# Altium schematic sheet 3_Airframe-Memory_1.SchDoc
size A3; SheetNumber: 4; SheetTotal: 9
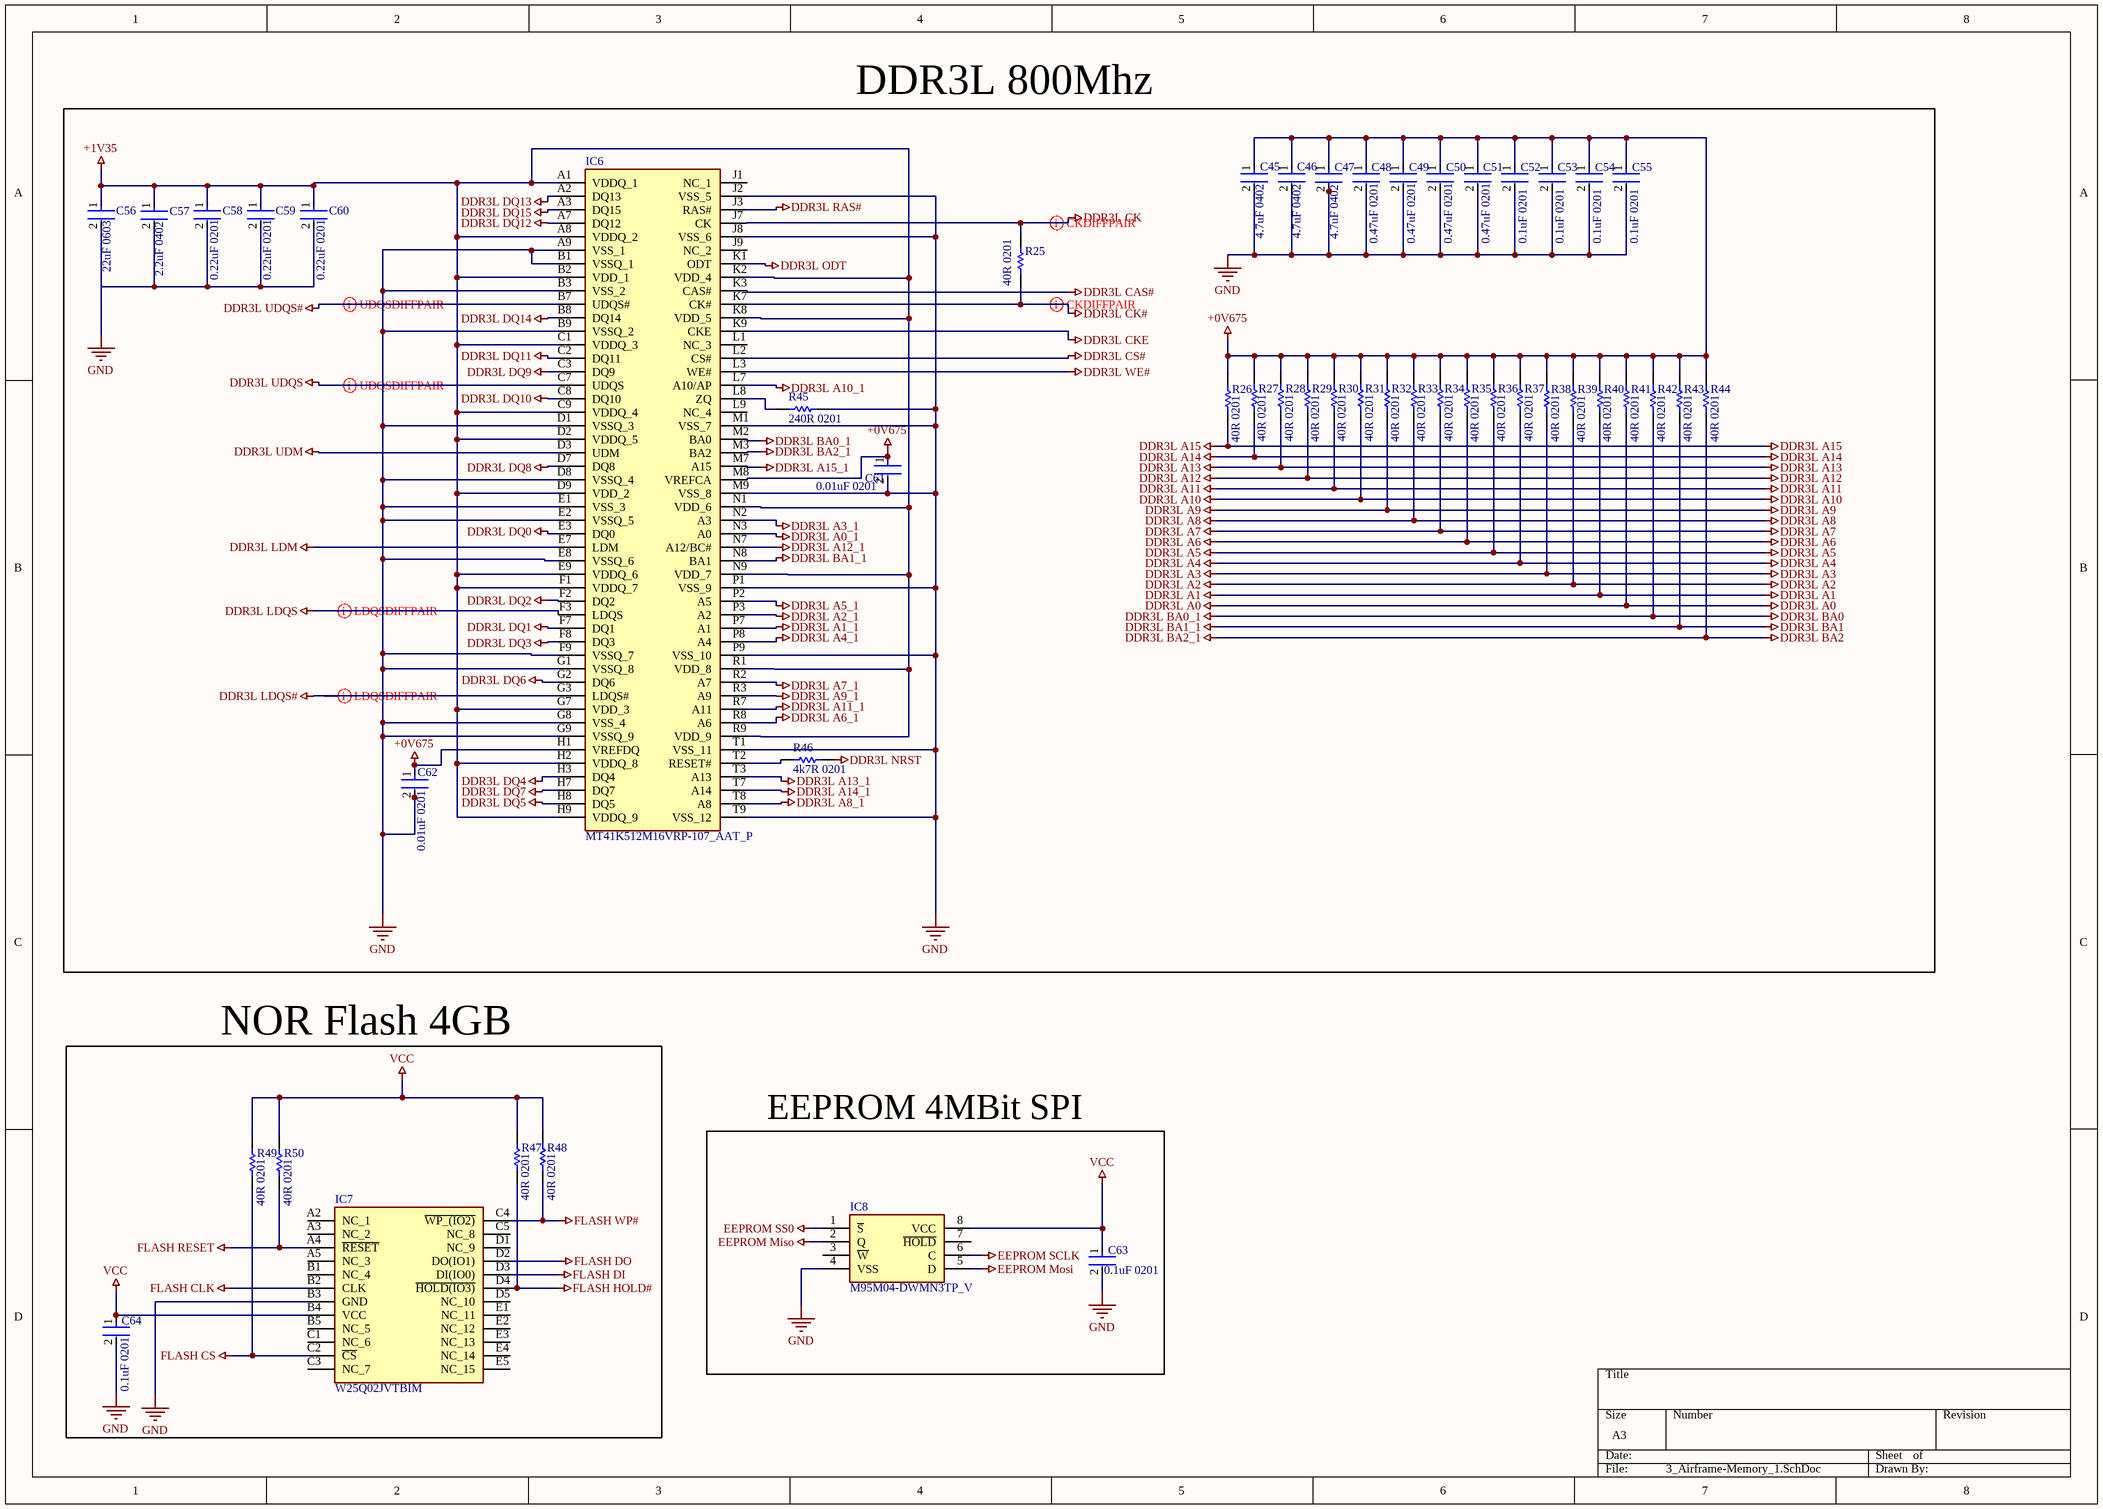
[diagram p0: 3_Airframe-Memory_1.SchDoc]

## Parts
C45  4.7uF 0402  [FP-C0402C225M9PACTU-MFG]
C46  4.7uF 0402  [FP-C0402C225M9PACTU-MFG]
C47  4.7uF 0402  [FP-C0402C225M9PACTU-MFG]
C48  0.47uF 0201  [FP-C0603-030-0_03-IPC_C]
C49  0.47uF 0201  [FP-C0603-030-0_03-IPC_C]
C50  0.47uF 0201  [FP-C0603-030-0_03-IPC_C]
C51  0.47uF 0201  [FP-C0603-030-0_03-IPC_C]
C52  0.1uF 0201  [FP-C0603-030-0_03-IPC_C]
C53  0.1uF 0201  [FP-C0603-030-0_03-IPC_C]
C54  0.1uF 0201  [FP-C0603-030-0_03-IPC_C]
C55  0.1uF 0201  [FP-C0603-030-0_03-IPC_C]
C56  22uF 0603  [FP-GRM188-0_2-IPC_C]
C57  2.2uF 0402  [FP-C0402C225M9PACTU-MFG]
C58  0.22uF 0201  [FP-C0603-030-0_03-IPC_C]
C59  0.22uF 0201  [FP-C0603-030-0_03-IPC_C]
C60  0.22uF 0201  [FP-C0603-030-0_03-IPC_C]
C61  0.01uF 0201  [FP-C0603-030-0_03-IPC_C]
C62  0.01uF 0201  [FP-C0603-030-0_03-IPC_C]
C63  0.1uF 0201  [FP-C0603-030-0_03-IPC_C]
C64  0.1uF 0201  [FP-C0603-030-0_03-IPC_C]
IC6  MT41K512M16VRP-107_AAT_P  [BGA96C80P9X16_800X1400X120]
IC7  W25Q02JVTBIM  [BGA24C100P5X5_600X800X120]
IC8  M95M04-DWMN3TP_V  [SOIC127P600X175-8N]
R25  40R 0201  [RESC0603X28X15NL05T05]
R26  40R 0201  [RESC0603X28X15NL05T05]
R27  40R 0201  [RESC0603X28X15NL05T05]
R28  40R 0201  [RESC0603X28X15NL05T05]
R29  40R 0201  [RESC0603X28X15NL05T05]
R30  40R 0201  [RESC0603X28X15NL05T05]
R31  40R 0201  [RESC0603X28X15NL05T05]
R32  40R 0201  [RESC0603X28X15NL05T05]
R33  40R 0201  [RESC0603X28X15NL05T05]
R34  40R 0201  [RESC0603X28X15NL05T05]
R35  40R 0201  [RESC0603X28X15NL05T05]
R36  40R 0201  [RESC0603X28X15NL05T05]
R37  40R 0201  [RESC0603X28X15NL05T05]
R38  40R 0201  [RESC0603X28X15NL05T05]
R39  40R 0201  [RESC0603X28X15NL05T05]
R40  40R 0201  [RESC0603X28X15NL05T05]
R41  40R 0201  [RESC0603X28X15NL05T05]
R42  40R 0201  [RESC0603X28X15NL05T05]
R43  40R 0201  [RESC0603X28X15NL05T05]
R44  40R 0201  [RESC0603X28X15NL05T05]
R45  240R 0201  [RESC0603X28X15NL05T05]
R46  4k7R 0201  [RESC0603X28X15NL05T05]
R47  40R 0201  [RESC0603X28X15NL05T05]
R48  40R 0201  [RESC0603X28X15NL05T05]
R49  40R 0201  [RESC0603X28X15NL05T05]
R50  40R 0201  [RESC0603X28X15NL05T05]

## Nets
+0V675: C45.1 C46.1 C47.1 C48.1 C49.1 C50.1 C51.1 C52.1 C53.1 C54.1 C55.1 C61.1 C62.1 IC6.H1(VREFDQ) IC6.M8(VREFCA) R26.2 R27.2 R28.2 R29.2 R30.2 R31.2 R32.2 R33.2 R34.2 R35.2 R36.2 R37.2 R38.2 R39.2 R40.2 R41.2 R42.2 R43.2 R44.2
+1V35: C56.1 C57.1 C58.1 C59.1 C60.1 IC6.A1(VDDQ_1) IC6.A8(VDDQ_2) IC6.B2(VDD_1) IC6.C1(VDDQ_3) IC6.C9(VDDQ_4) IC6.D2(VDDQ_5) IC6.D9(VDD_2) IC6.E9(VDDQ_6) IC6.F1(VDDQ_7) IC6.G7(VDD_3) IC6.H2(VDDQ_8) IC6.H9(VDDQ_9) IC6.K2(VDD_4) IC6.K8(VDD_5) IC6.N1(VDD_6) IC6.N9(VDD_7) IC6.R1(VDD_8) IC6.R9(VDD_9)
DDR3L A0: R41.1
DDR3L A0_1: IC6.N3(A0)
DDR3L A1: R40.1
DDR3L A1_1: IC6.P7(A1)
DDR3L A2: R39.1
DDR3L A2_1: IC6.P3(A2)
DDR3L A3: R38.1
DDR3L A3_1: IC6.N2(A3)
DDR3L A4: R37.1
DDR3L A4_1: IC6.P8(A4)
DDR3L A5: R36.1
DDR3L A5_1: IC6.P2(A5)
DDR3L A6: R35.1
DDR3L A6_1: IC6.R8(A6)
DDR3L A7: R34.1
DDR3L A7_1: IC6.R2(A7)
DDR3L A8: R33.1
DDR3L A8_1: IC6.T8(A8)
DDR3L A9: R32.1
DDR3L A9_1: IC6.R3(A9)
DDR3L A10: R31.1
DDR3L A10_1: IC6.L7(A10/AP)
DDR3L A11: R30.1
DDR3L A11_1: IC6.R7(A11)
DDR3L A12: R29.1
DDR3L A12_1: IC6.N7(A12/BC#)
DDR3L A13: R28.1
DDR3L A13_1: IC6.T3(A13)
DDR3L A14: R27.1
DDR3L A14_1: IC6.T7(A14)
DDR3L A15: R26.1
DDR3L A15_1: IC6.M7(A15)
DDR3L BA0: IC6.M2(BA0) R42.1  [also labelled DDR3L BA0_1]
DDR3L BA1: IC6.N8(BA1) R43.1  [also labelled DDR3L BA1_1]
DDR3L BA2: IC6.M3(BA2) R44.1  [also labelled DDR3L BA2_1]
DDR3L CAS#: IC6.K3(CAS#)
DDR3L CK: IC6.J7(CK) R25.2
DDR3L CK#: IC6.K7(CK#) R25.1
DDR3L CKE: IC6.K9(CKE)
DDR3L CS#: IC6.L2(CS#)
DDR3L DQ0: IC6.E3(DQ0)
DDR3L DQ1: IC6.F7(DQ1)
DDR3L DQ2: IC6.F2(DQ2)
DDR3L DQ3: IC6.F8(DQ3)
DDR3L DQ4: IC6.H3(DQ4)
DDR3L DQ5: IC6.H8(DQ5)
DDR3L DQ6: IC6.G2(DQ6)
DDR3L DQ7: IC6.H7(DQ7)
DDR3L DQ8: IC6.D7(DQ8)
DDR3L DQ9: IC6.C3(DQ9)
DDR3L DQ10: IC6.C8(DQ10)
DDR3L DQ11: IC6.C2(DQ11)
DDR3L DQ12: IC6.A7(DQ12)
DDR3L DQ13: IC6.A2(DQ13)
DDR3L DQ14: IC6.B8(DQ14)
DDR3L DQ15: IC6.A3(DQ15)
DDR3L LDM: IC6.E7(LDM)
DDR3L LDQS: IC6.F3(LDQS)
DDR3L LDQS#: IC6.G3(LDQS#)
DDR3L NRST: R46.2
DDR3L ODT: IC6.K1(ODT)
DDR3L RAS#: IC6.J3(RAS#)
DDR3L UDM: IC6.D3(UDM)
DDR3L UDQS: IC6.C7(UDQS)
DDR3L UDQS#: IC6.B7(UDQS#)
DDR3L WE#: IC6.L3(WE#)
EEPROM Miso: IC8.2(Q)
EEPROM Mosi: IC8.5(D)
EEPROM SCLK: IC8.6(C)
EEPROM SS0: IC8.1(~{S})
FLASH CLK: IC7.B2(CLK)
FLASH CS: IC7.C2(~{CS}) R49.1
FLASH DI: IC7.D3(DI(IO0))
FLASH DO: IC7.D2(DO(IO1))
FLASH HOLD#: IC7.D4(~{HOLD(IO3)}) R47.1
FLASH RESET: IC7.A4(~{RESET}) R50.1
FLASH WP#: IC7.C4(~{WP_(IO2)}) R48.1
GND: C45.2 C46.2 C47.2 C48.2 C49.2 C50.2 C51.2 C52.2 C53.2 C54.2 C55.2 C56.2 C57.2 C58.2 C59.2 C60.2 C61.2 C62.2 C63.2 C64.2 IC6.A9(VSS_1) IC6.B1(VSSQ_1) IC6.B3(VSS_2) IC6.B9(VSSQ_2) IC6.D1(VSSQ_3) IC6.D8(VSSQ_4) IC6.E1(VSS_3) IC6.E2(VSSQ_5) IC6.E8(VSSQ_6) IC6.F9(VSSQ_7) IC6.G1(VSSQ_8) IC6.G8(VSS_4) IC6.G9(VSSQ_9) IC6.J2(VSS_5) IC6.J8(VSS_6) IC6.M1(VSS_7) IC6.M9(VSS_8) IC6.P1(VSS_9) IC6.P9(VSS_10) IC6.T1(VSS_11) IC6.T9(VSS_12) IC7.B3(GND) IC8.4(VSS) R45.2
VCC: C63.1 C64.1 IC7.B4(VCC) IC8.8(VCC) R47.2 R48.2 R49.2 R50.2
NetIC6_L8: IC6.L8(ZQ) R45.1
NetIC6_T2: IC6.T2(RESET#) R46.1

Not connected (* = marked no-connect by the designer): IC6 J1(NC_1) J9(NC_2) L1(NC_3) L9(NC_4); IC7 A2(NC_1) A3(NC_2) A5(NC_3) B1(NC_4) B5(NC_5) C1(NC_6) C3(NC_7) C5(NC_8) D1(NC_9) D5(NC_10) E1(NC_11) E2(NC_12) E3(NC_13) E4(NC_14) E5(NC_15); IC8 3(~{W}) 7(~{HOLD})

## Layout directives
differential pair: DDR3L CK, DDR3L CK#, DDR3L LDQS, DDR3L LDQS#, DDR3L UDQS, DDR3L UDQS#

## Notes on the sheet
- DDR3L 800Mhz
- NOR Flash 4GB
- EEPROM 4MBit SPI

## Library data of the parts
C45-C47 C57 = CMP-2008-02064-3: CAP CER 2.2UF 6.3V X5R 0402; Tolerance: 20%; Dissipation Factor: 5%; Dielectric Material: Ceramic; Lead Free: Lead Free; Depth: 0.5mm; Series: C; Termination: SMD/SMT; Case Code (Metric): 1005; Case/Package: 0402; Dielectric: X5R; RoHS Compliant: Yes; Thickness: 0.022inch; Voltage Rating: 6.3V; Voltage: 6.3V; Height: 0.5mm; Mount: Surface Mount; Construction: Flat; Case Code (Imperial): 0402; Min Operating Temperature: -55°C; Contact Plating: Tin; Radiation Hardening: No; Number of Pins: 2; Voltage Rating (DC): 6.3V; Capacitance: 2.2uF; Width: 0.5mm; Package Quantity: 1; Packaging: Tape and Reel; Max Operating Temperature: 85°C; Length: 1mm; REACH SVHC: No SVHC
C48-C55 C58-C64 = CMP-08246-007095-1: Multilayer Ceramic Capacitors 220nF ±10% 6.3V X6S SMD 0201; Dielectric: X6S; Resistor Type: Ceramic; Length: 0.6mm; Capacitance: 220nF; Case Code (Metric): 0603; Series: C; Width: 0.012inch; Height: 0.3mm; Voltage Rating: 6.3V; Max Operating Temperature: 105°C; REACH SVHC: No SVHC; RoHS Compliant: Yes; Tolerance: 10%; Termination: SMD/SMT; Case/Package: 0201; Case Code (Imperial): 0201; Weight: 6E-06oz; Lead Free: Lead Free; Construction: Flat; Thickness: 300um; Mount: Surface Mount; Dielectric Material: Ceramic; Voltage Rating (DC): 6.3V; Packaging: Cut Tape; Package Quantity: 1; Min Operating Temperature: -55°C; Depth: 0.3mm
C56 = CMP-2000-06337-3: Chip Multilayer Ceramic Capacitors for General Purpose, 0603, 22uF, X5R, 15%, 20%, 10V; Tolerance: 20%; Weight: 0.000222oz; Material: Ceramic; Depth: 0.8mm; Length: 1.6mm; Termination: SMD/SMT; Capacitance: 22uF; Packaging: Tape and Reel; Width: 0.8mm; Voltage Rating: 10V; Case Code (Imperial): 0603; Mount: Surface Mount; Voltage Rating (DC): 10V; Case/Package: 0603; Thickness: 0.039inch; REACH SVHC: No SVHC; Dielectric: X5R; Height: 0.8mm; Package Quantity: 4000; Case Code (Metric): 1608; Min Operating Temperature: -55°C; Lead Free: Lead Free; Max Operating Temperature: 85°C
IC6 = MT41K512M16VRP-107_AAT_P: Integrated Circuit; Manufacturer_Name: Micron; Manufacturer_Part_Number: MT41K512M16VRP-107 AAT:P; Datasheet Link: https://media-www.micron.com/-/media/client/global/documents/products/data-sheet/dram/ddr3/ddr3l_8gb_x16_1cs_twindie_v00h.pdf?rev=22af12ce29de4defa41e06e9beebd61f; Height: 1.2mm; Mouser Part Number: 340-446578-TRAY; Mouser Price/Stock: https://www.mouser.co.uk/ProductDetail/Micron/MT41K512M16VRP-107-AATP?qs=vHuUswq2%252Bsx8WmnHcfGgyw%3D%3D; Arrow Part Number: MT41K512M16VRP-107 AAT:P; Arrow Price/Stock: https://www.arrow.com/en/products/mt41k512m16vrp-107-aatp/micron-technology?region=nac
IC7 = W25Q02JVTBIM: Integrated Circuit; Manufacturer_Name: Winbond; Datasheet Link: https://www.mouser.com/datasheet/2/949/W25Q02JV_DTR_RevB_04192021-2329042.pdf; Height: 1.2mm; Manufacturer_Part_Number: W25Q02JVTBIM; Mouser Part Number: 454-W25Q02JVTBIM; Mouser Price/Stock: https://www.mouser.co.uk/ProductDetail/Winbond/W25Q02JVTBIM?qs=TuK3vfAjtkVTVCDKxnTswg%3D%3D; Arrow Part Number: W25Q02JVTBIM; Arrow Price/Stock: https://www.arrow.com/en/products/w25q02jvtbim/winbond-electronics?region=nac
IC8 = M95M04-DWMN3TP_V: Integrated Circuit; Manufacturer_Name: STMicroelectronics; Manufacturer_Part_Number: M95M04-DWMN3TP/V; Datasheet Link: https://www.st.com/resource/en/datasheet/dm00345675.pdf; Height: 1.75mm; Mouser Part Number: 511-M95M04-DWMN3TP/V; Mouser Price/Stock: https://www.mouser.co.uk/ProductDetail/STMicroelectronics/M95M04-DWMN3TP-V?qs=Jslch3jnSjmvFWprUQ0dSQ%3D%3D; Arrow Part Number: M95M04-DWMN3TP/V; Arrow Price/Stock: https://www.arrow.com/en/products/m95m04-dwmn3tpv/stmicroelectronics?region=nac
R25-R50 = CMP-2004-00006-1: Manufacturer: Vishay; Part Number: CRCW0201100RFNED